# EAGLE design mega (EAGLE 9.2.2)
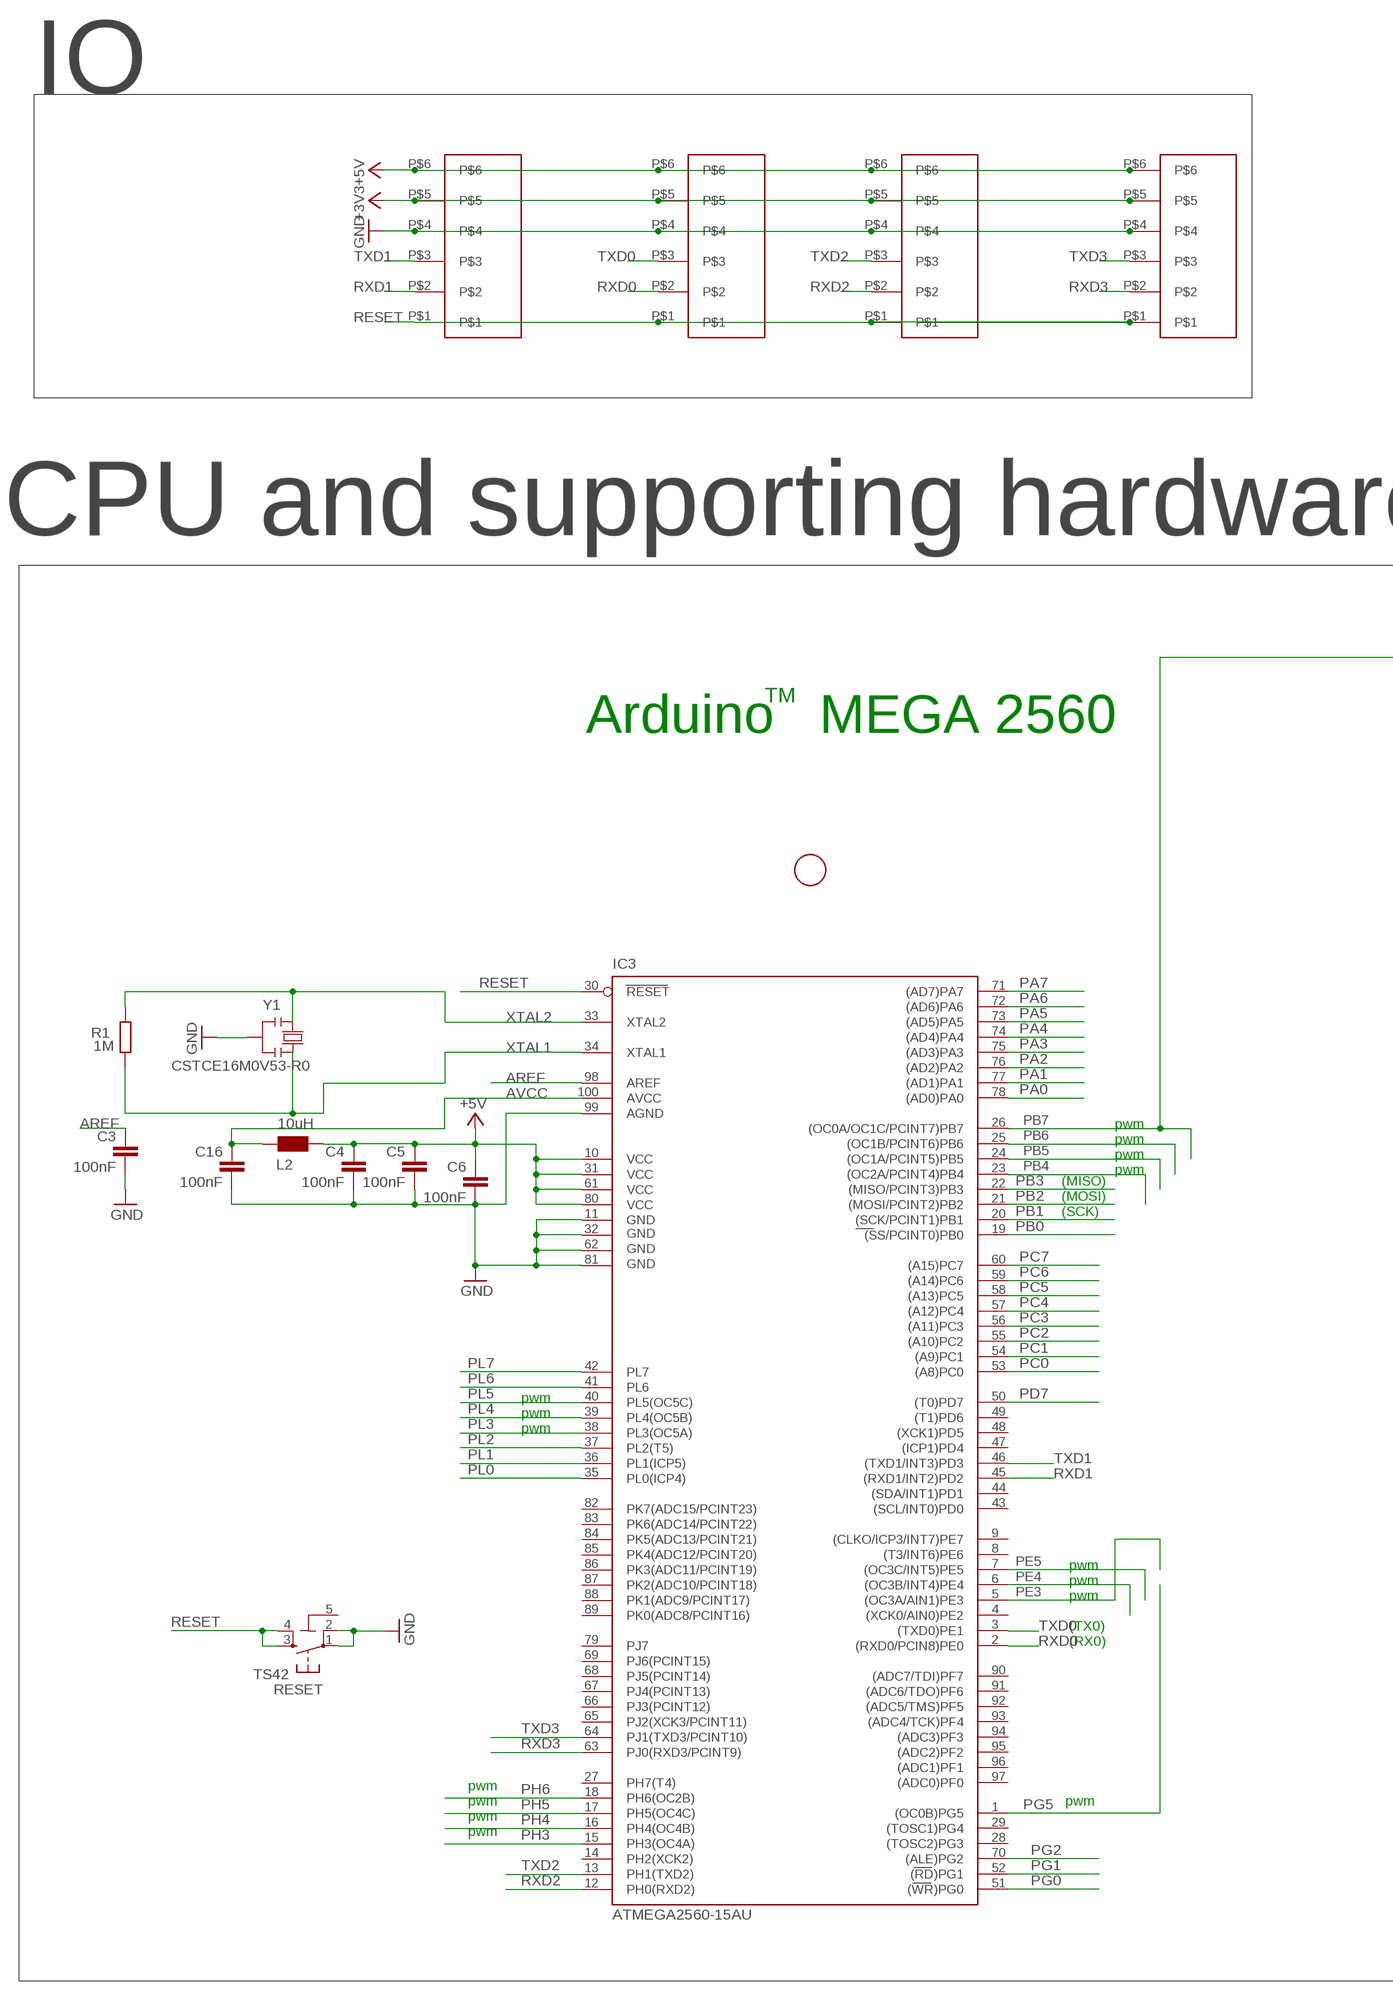
[diagram p0: schematic, sheet 1, part 1 of 2]
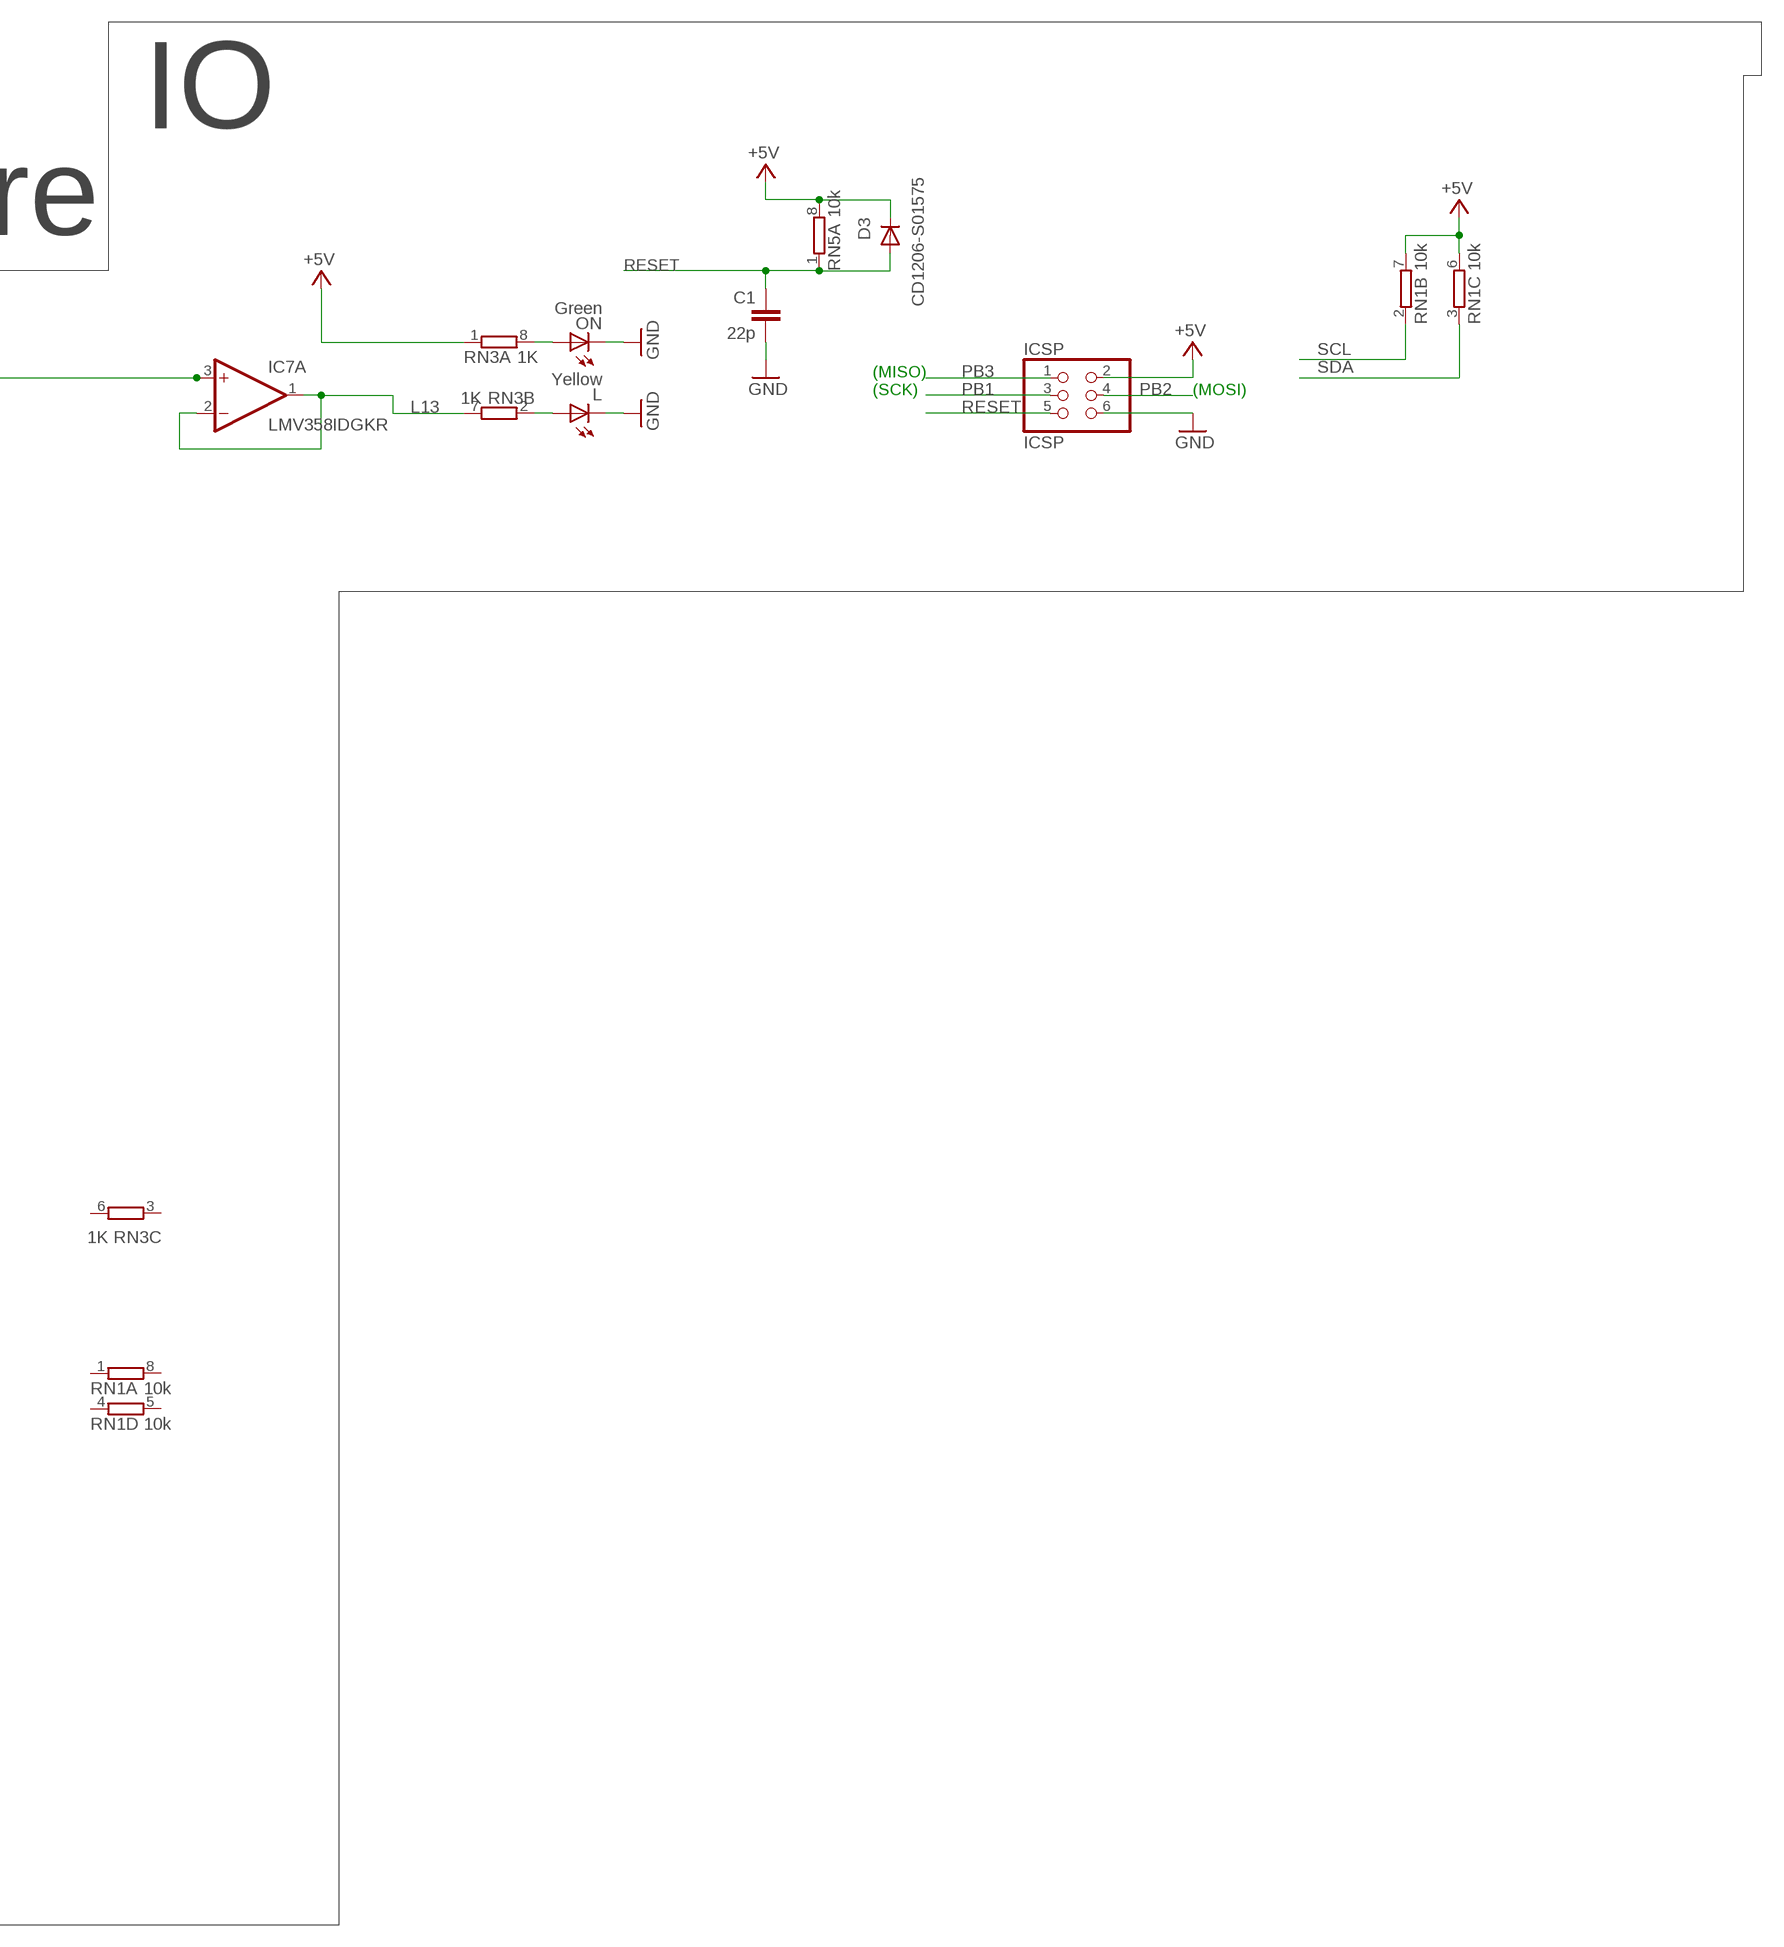
[diagram p1: schematic, sheet 1, part 2 of 2]

## Parts
C1  22p  0014_22PF_0603  [C0603-ROUND]
C3  100nF  0015_100NF_0603  [C0603-ROUND]
C4  100nF  0015_100NF_0603  [C0603-ROUND]
C5  100nF  0015_100NF_0603  [C0603-ROUND]
C6  100nF  0015_100NF_0603  [C0603-ROUND]
C16  100nF  0015_100NF_0603  [C0603-ROUND]
D3  CD1206-S01575  0012_CD1206-S01575  [MINIMELF]
FD4  FIDUCIALMOUNT  [FIDUCIA-MOUNT]
IC3  ATMEGA2560-15AU  0023_ATMEGA2560-16AU  [TQFP100]
IC7  LMV358IDGKR  0021_LMV358IDGKR  [MSOP08]
ICSP  ICSP  0114_PH254-203DF118A00V  [2X03]
L  Yellow  0044_KPT-2012YC  [CHIPLED_0805]
L2  10uH  0715_CV201210-100K  [0805]
ON  Green  0043_KPT-2012SGC  [CHIPLED_0805]
R1  1M  0004_0603_1M  [R0603-ROUND]
RESET  TS42  0946_TS42031-160W-TR-7260  [TS42]
RN1  10k  0016_064R_10K_/_CAY16-103J4LF  [CAY16]
RN3  1K  0005_064R_1K_/_CAY16-102J4LF  [CAY16]
RN5  10k  0016_064R_10K_/_CAY16-103J4LF  [CAY16]
U$2  6PINHERM  [6PINHERMSMD]
U$3  6PINHERM  [6PINHERMSMD]
U$4  6PINHERM  [6PINHERMSMD]
U$5  6PINHERM  [6PINHERMSMD]
Y1  CSTCE16M0V53-R0  0011_CSTCE16M0V53-R0  [RESONATOR]

## Nets
+3V3 [power]: U$2.P$5 U$3.P$5 U$4.P$5 U$5.P$5
+5V [power usb]: C4.1 C5.1 C6.1 D3.C IC3.10(VCC) IC3.31(VCC1) IC3.61(VCC2) IC3.80(VCC3) ICSP.2 L2.2 RN1.6 RN1.7 RN3.1 RN5.8 U$2.P$6 U$3.P$6 U$4.P$6 U$5.P$6
AREF: C3.1 IC3.98(AREF)
AVCC [power usb]: C16.1 IC3.100(AVCC) L2.1
GND [gnd]: C1.2 C3.2 C4.2 C5.2 C6.2 C16.2 IC3.11(GND) IC3.32(GND1) IC3.62(GND2) IC3.81(GND3) IC3.99(AGND) ICSP.6 L.C ON.C RESET.1 RESET.2 U$2.P$4 U$3.P$4 U$4.P$4 U$5.P$4 Y1.2
L13: IC7.1(A:OUT) IC7.2(A:-IN) RN3.7
N$2: L.A RN3.2
N$3: ON.A RN3.8
PA0: IC3.78((AD0)PA0)
PA1: IC3.77((AD1)PA1)
PA2: IC3.76((AD2)PA2)
PA3: IC3.75((AD3)PA3)
PA4: IC3.74((AD4)PA4)
PA5: IC3.73((AD5)PA5)
PA6: IC3.72((AD6)PA6)
PA7: IC3.71((AD7)PA7)
PB0: IC3.19((SS/PCINT0)PB0)
PB1: IC3.20((SCK/PCINT1)PB1) ICSP.3
PB2: IC3.21((MOSI/PCINT2)PB2) ICSP.4
PB3: IC3.22((MISO/PCINT3)PB3) ICSP.1
PB4: IC3.23((OC2A/PCINT4)PB4)
PB5: IC3.24((OC1A/PCINT5)PB5)
PB6: IC3.25((OC1B/PCINT6)PB6)
PB7: IC3.26((OC0A/OC1C/PCINT7)PB7) IC7.3(A:+IN)
PC0: IC3.53((A8)PC0)
PC1: IC3.54((A9)PC1)
PC2: IC3.55((A10)PC2)
PC3: IC3.56((A11)PC3)
PC4: IC3.57((A12)PC4)
PC5: IC3.58((A13)PC5)
PC6: IC3.59((A14)PC6)
PC7: IC3.60((A15)PC7)
PD7: IC3.50((T0)PD7)
PE3: IC3.5((OC3A/AIN1)PE3)
PE4: IC3.6((OC3B/INT4)PE4)
PE5: IC3.7((OC3C/INT5)PE5)
PG0: IC3.51((WR)PG0)
PG1: IC3.52((RD)PG1)
PG2: IC3.70((ALE)PG2)
PG5: IC3.1((OC0B)PG5)
PH3: IC3.15(PH3(OC4A))
PH4: IC3.16(PH4(OC4B))
PH5: IC3.17(PH5(OC4C))
PH6: IC3.18(PH6(OC2B))
PL0: IC3.35(PL0(ICP4))
PL1: IC3.36(PL1(ICP5))
PL2: IC3.37(PL2(T5))
PL3: IC3.38(PL3(OC5A))
PL4: IC3.39(PL4(OC5B))
PL5: IC3.40(PL5(OC5C))
PL6: IC3.41(PL6)
PL7: IC3.42(PL7)
RESET: C1.1 D3.A IC3.30(RESET) ICSP.5 RESET.3 RESET.4 RN5.1 U$2.P$1 U$3.P$1 U$4.P$1 U$5.P$1
RXD0: IC3.2((RXD0/PCIN8)PE0) U$4.P$2
RXD1: IC3.45((RXD1/INT2)PD2) U$2.P$2
RXD2: IC3.12(PH0(RXD2)) U$5.P$2
RXD3: IC3.63(PJ0(RXD3/PCINT9)) U$3.P$2
SCL: RN1.2
SDA: RN1.3
TXD0: IC3.3((TXD0)PE1) U$4.P$3
TXD1: IC3.46((TXD1/INT3)PD3) U$2.P$3
TXD2: IC3.13(PH1(TXD2)) U$5.P$3
TXD3: IC3.64(PJ1(TXD3/PCINT10)) U$3.P$3
XTAL1: IC3.34(XTAL1) R1.1 Y1.3
XTAL2: IC3.33(XTAL2) R1.2 Y1.1
Unconnected: IC3.4((XCK0/AIN0)PE2) IC3.8((T3/INT6)PE6) IC3.9((CLKO/ICP3/INT7)PE7) IC3.14(PH2(XCK2)) IC3.27(PH7(T4)) IC3.28((TOSC2)PG3) IC3.29((TOSC1)PG4) IC3.43((SCL/INT0)PD0) IC3.44((SDA/INT1)PD1) IC3.47((ICP1)PD4) IC3.48((XCK1)PD5) IC3.49((T1)PD6) IC3.65(PJ2(XCK3/PCINT11)) IC3.66(PJ3(PCINT12)) IC3.67(PJ4(PCINT13)) IC3.68(PJ5(PCINT14)) IC3.69(PJ6(PCINT15)) IC3.79(PJ7) IC3.82(PK7(ADC15/PCINT23)) IC3.83(PK6(ADC14/PCINT22)) IC3.84(PK5(ADC13/PCINT21)) IC3.85(PK4(ADC12/PCINT20)) IC3.86(PK3(ADC11/PCINT19)) IC3.87(PK2(ADC10/PCINT18)) IC3.88(PK1(ADC9/PCINT17)) IC3.89(PK0(ADC8/PCINT16)) IC3.90((ADC7/TDI)PF7) IC3.91((ADC6/TDO)PF6) IC3.92((ADC5/TMS)PF5) IC3.93((ADC4/TCK)PF4) IC3.94((ADC3)PF3) IC3.95((ADC2)PF2) IC3.96((ADC1)PF1) IC3.97((ADC0)PF0) IC7.5(B:+IN) IC7.6(B:-IN) IC7.7(B:OUT) RN1.1 RN1.4 RN1.5 RN1.8 RN3.3 RN3.4 RN3.5 RN3.6 RN5.2 RN5.3 RN5.4 RN5.5 RN5.6 RN5.7

## Notes on the sheet
- IO
- IO
- CPU and supporting hardware
- (MISO)
- (SCK) | (MOSI)
- TM
- Arduino   MEGA 2560
- pwm
- pwm
- pwm
- pwm
- (MISO)
- (MOSI)
- (SCK)
- pwm
- pwm
- pwm
- pwm
- pwm
- pwm
- (TX0)
- (RX0)
- pwm
- pwm | pwm
- pwm
- pwm

## Power pins joined to a net without a drawn wire
5-GND: RESET.5(5-GND)
V+: IC7.8(P:V+)
V-: IC7.4(P:V-)

## Library data of the parts
C1 = Condensatori:0014_22PF_0603: 22pF 0603; CASE: 0603; MONTHLY_USAGE: _____; PART_NUMBER: 22pF_0603; PRICE: _____; SUPPLIER: _____; TYPE: Condensatori
C3-C6 C16 = Condensatori:0015_100NF_0603: 100nF 0603 50V; CASE: 0603; MONTHLY_USAGE: _____; PART_NUMBER: cl10b104kbnc; PRICE: _____; SUPPLIER: _____; TYPE: Condensatori
D3 = Diodi:0012_CD1206-S01575: small-signal high-speed Switching Diodes CD1206; CASE: 1206; MONTHLY_USAGE: _____; PART_NUMBER: CD1206-S01575; PRICE: _____; SUPPLIER: _____; TYPE: Diodi
FD4 = SmartPrj:FIDUCIALMOUNT
IC3 = IntegratedCircuits:0023_ATMEGA2560-16AU: 8-bit Microcontroller with 256K Bytes In-System Programmable Flash - ATMEGA2560-16AU; CASE: TQFP100_14x14; MONTHLY_USAGE: _____; PART_NUMBER: ATMEGA2560-16AU; PRICE: _____; SUPPLIER: _____; TYPE: Circuito_Integrato
IC7 = IntegratedCircuits:0021_LMV358IDGKR: Dual low-voltage (2.7 V to 5.5 V), operational amplifiers with rail-to-rail output swing LMV358IDGKR; CASE: MSOP8; MONTHLY_USAGE: _____; PART_NUMBER: LMV358IDGKR; PRICE: _____; SUPPLIER: _____; TYPE: Circuito_Integrato
ICSP = Connettori:0114_PH254-203DF118A00V: 3x2 M V h 8,5 mm p2,54; MONTHLY_USAGE: _____; PART_NUMBER: PH254-203DF118A00V; PRICE: _____; SUPPLIER: _____; TYPE: Connettori
L = Opto:0044_KPT-2012YC: LED YELLOW - SMD - 0805; MONTHLY_USAGE: _____; PART_NUMBER: KPT-2012YC; PRICE: _____; SUPPLIER: _____; TYPE: Opto
L2 = Induttanze:0715_CV201210-100K: 10uH 0805; CASE: 0805; MONTHLY_USAGE: _____; PART_NUMBER: CV201210-100K; PRICE: _____; SUPPLIER: _____; TYPE: Induttanze
ON = Opto:0043_KPT-2012SGC: LED GREEN - SMD-0805; MONTHLY_USAGE: _____; PART_NUMBER: KPT-2012SGC; PRICE: _____; SUPPLIER: _____; TYPE: Opto
R1 = Resistenze:0004_0603_1M: 1M 0603; CASE: 0603; MONTHLY_USAGE: _____; PART_NUMBER: 0603_1M; PRICE: _____; SUPPLIER: _____; TYPE: Resistenze
RESET = Switches:0946_TS42031-160W-TR-7260: Pushbutton 6x6 Smd - White; MONTHLY_USAGE: _____; PART_NUMBER: IT-1157AHNP-160G-G_GTR; PRICE: _____; SUPPLIER: _____; TYPE: Switches
RN1 RN5 = Resistenze:0016_064R_10K_/_CAY16-103J4LF: 10K 064 R; CASE: SMD_3,2x1,6; MONTHLY_USAGE: _____; PART_NUMBER: 064R_10K_/_CAY16-103J4LF; PRICE: _____; SUPPLIER: _____; TYPE: Resistenze
RN3 = Resistenze:0005_064R_1K_/_CAY16-102J4LF: 1K 064R; CASE: SMD_3,2x1,6; MONTHLY_USAGE: _____; PART_NUMBER: 064R_1K_/_CAY16-102J4LF; PRICE: _____; SUPPLIER: _____; TYPE: Resistenze
U$2-U$5 = te_conectivity_6_pin_herm:6PINHERM: https://www.mouser.com/ProductDetail/TE-Connectivity/2213611-3?qs=sGAEpiMZZMsg%252bek5lc7F5uB08Utn55q4E3YUmFQRoIY%3d
Y1 = Cristalli:0011_CSTCE16M0V53-R0: 16Mhz - SMD; MONTHLY_USAGE: _____; PART_NUMBER: CSTCE16M0V53-R0; PRICE: _____; SUPPLIER: _____; TYPE: Cristalli

## Net classes
0 default: width 0.203 mm, drill 0.406 mm, clearance 0.203 mm
1 power: width 0.61 mm, drill 0.406 mm, clearance 0.203 mm
2 gnd: width 0.305 mm, drill 0.406 mm, clearance 0.203 mm
3 power usb: width 0.508 mm, drill 0.406 mm, clearance 0.203 mm

## Board
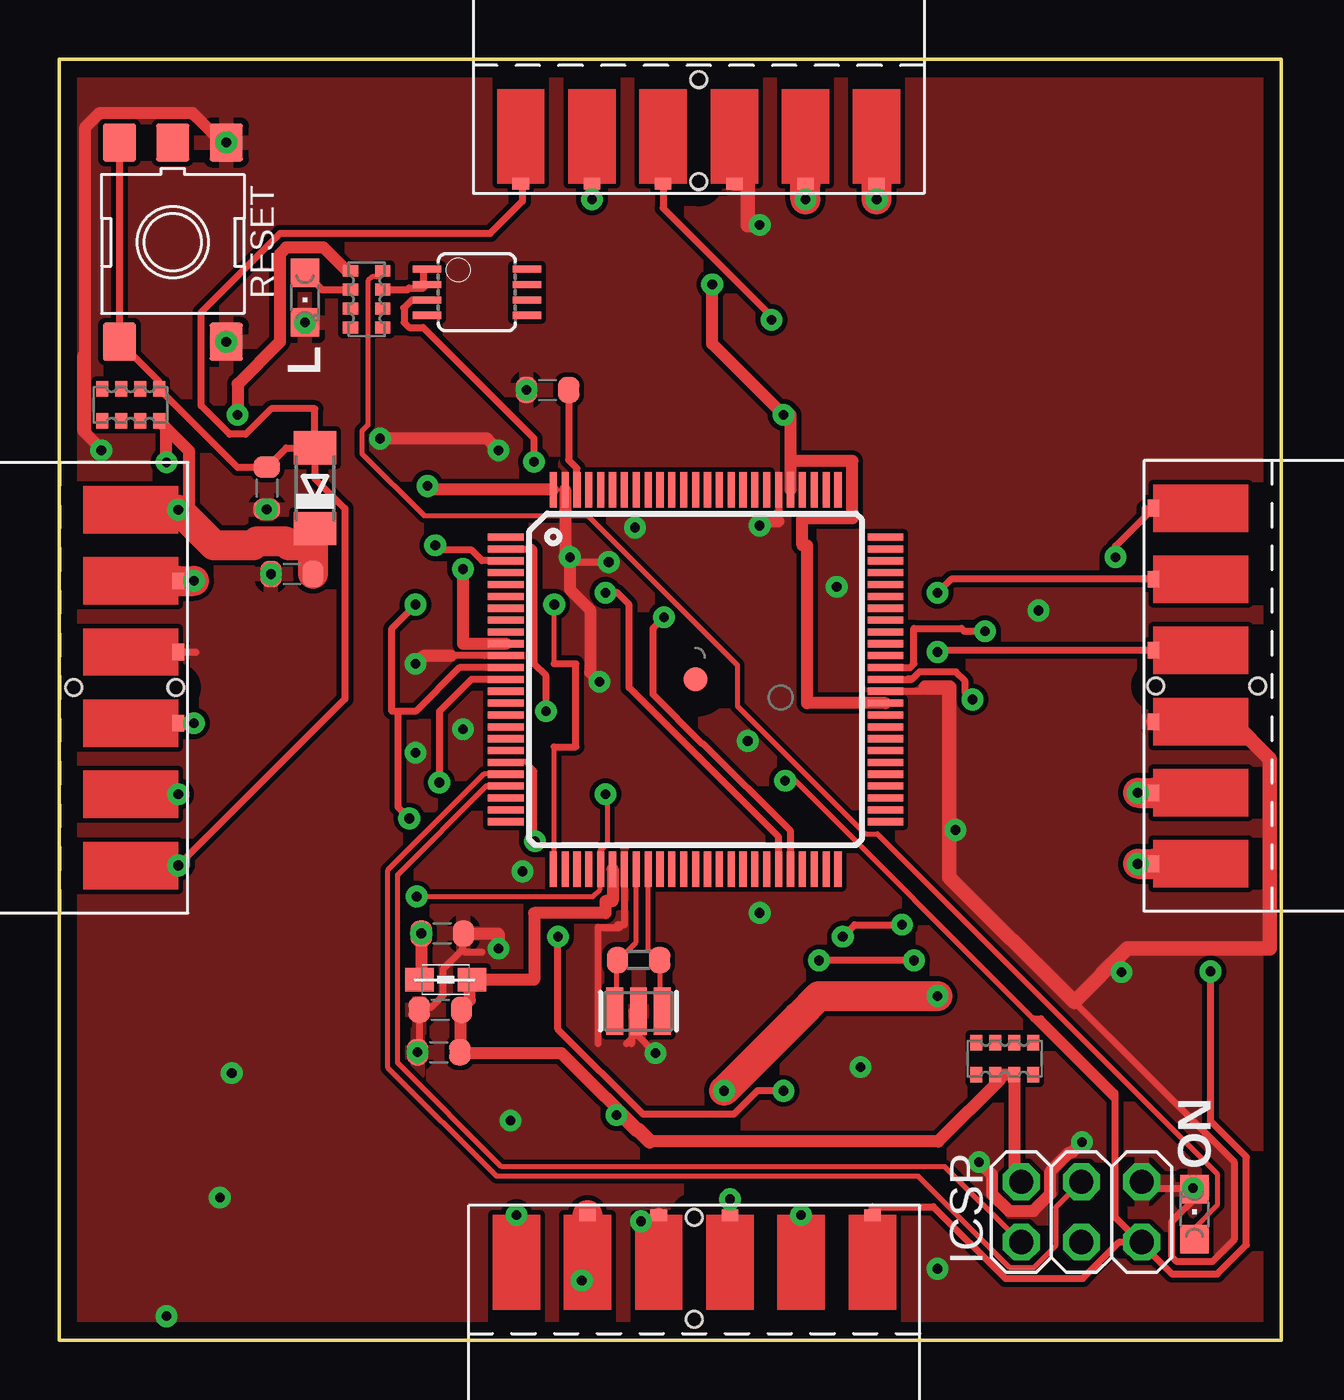
[diagram p2: board, top side]
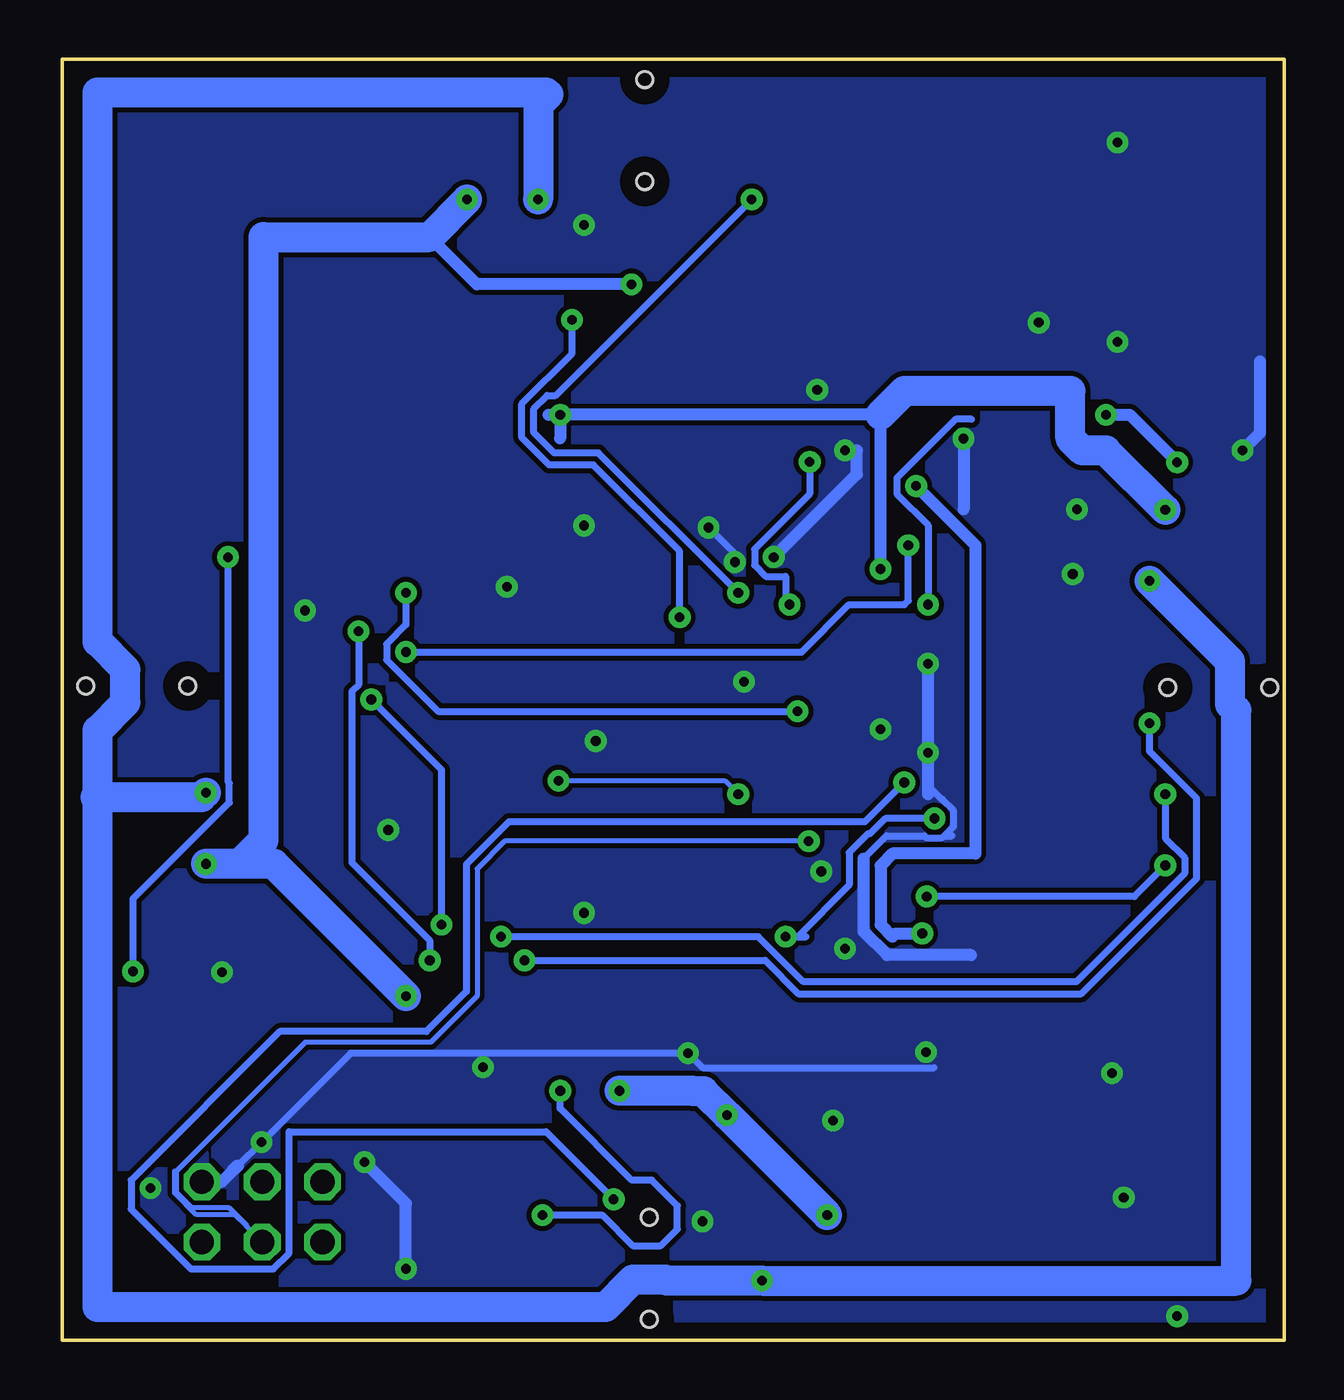
[diagram p3: board, bottom side, seen from below]

Size 51.5 x 54 mm. Coordinates in mm from the lower left corner, seen from the top.
Outline: 0,54 51.5,54 51.5,0 0,0 0,54
Copper layers (1*16): Top 0.035mm / dielectric 1.5mm / Bottom 0.035mm
Design rules "ArduinoMega *": minimum track width 8mil, minimum drill 16mil, track to track 7mil, track to pad 7mil, pad to pad 8mil, via to via 10mil, smd to smd 7mil, copper to edge 27mil, drill to drill 12mil, minimum pad ring 10mil, minimum via ring 10mil, stop-mask expansion 2mil, vias tented up to drill 24mil, thermal gap 10mil

### Footprints (pad centres in the part's own frame; a part is rotated, then mirrored left to right if it is on the bottom)
C0603-ROUND = smd 0.898 x 1.1: 1 -0.889,0; 2 0.889,0
MINIMELF = smd 1.4 x 1.8: A 1.7,0; C -1.7,0
FIDUCIA-MOUNT = smd 1.016 x 1.016: P$1 0,0
TQFP100 = smd 1.5 x 0.3: 1 -8,6; 2 -8,5.5; 3 -8,5; 4 -8,4.5; 5 -8,4; 6 -8,3.5; 7 -8,3; 8 -8,2.5; 9 -8,2; 10 -8,1.5; 11 -8,1; 12 -8,0.5; 13 -8,0; 14 -8,-0.5; 15 -8,-1; 16 -8,-1.5; 17 -8,-2; 18 -8,-2.5; 19 -8,-3; 20 -8,-3.5; 21 -8,-4; 22 -8,-4.5; 23 -8,-5; 24 -8,-5.5; 25 -8,-6; 51 8,-6; 52 8,-5.5; 53 8,-5; 54 8,-4.5; 55 8,-4; 56 8,-3.5; 57 8,-3; 58 8,-2.5; 59 8,-2; 60 8,-1.5; 61 8,-1; 62 8,-0.5; 63 8,0; 64 8,0.5; 65 8,1; 66 8,1.5; 67 8,2; 68 8,2.5; 69 8,3; 70 8,3.5; 71 8,4; 72 8,4.5; 73 8,5; 74 8,5.5; 75 8,6 | smd 0.3 x 1.5: 26 -6,-8; 27 -5.5,-8; 28 -5,-8; 29 -4.5,-8; 30 -4,-8; 31 -3.5,-8; 32 -3,-8; 33 -2.5,-8; 34 -2,-8; 35 -1.5,-8; 36 -1,-8; 37 -0.5,-8; 38 0,-8; 39 0.5,-8; 40 1,-8; 41 1.5,-8; 42 2,-8; 43 2.5,-8; 44 3,-8; 45 3.5,-8; 46 4,-8; 47 4.5,-8; 48 5,-8; 49 5.5,-8; 50 6,-8; 76 6,8; 77 5.5,8; 78 5,8; 79 4.5,8; 80 4,8; 81 3.5,8; 82 3,8; 83 2.5,8; 84 2,8; 85 1.5,8; 86 1,8; 87 0.5,8; 88 0,8; 89 -0.5,8; 90 -1,8; 91 -1.5,8; 92 -2,8; 93 -2.5,8; 94 -3,8; 95 -3.5,8; 96 -4,8; 97 -4.5,8; 98 -5,8; 99 -5.5,8; 100 -6,8
MSOP08 = smd 0.3 x 1.2: 1 -0.976,-2.113; 2 -0.326,-2.113; 3 0.324,-2.113; 4 0.974,-2.113; 5 0.974,2.112; 6 0.324,2.112; 7 -0.326,2.112; 8 -0.976,2.112
2X03 = drill 1.016 pad 1.55 octagon: 1 -2.54,-1.27; 2 -2.54,1.27; 3 0,-1.27; 4 0,1.27; 5 2.54,-1.27; 6 2.54,1.27
CHIPLED_0805 = smd 1.2 x 1.2: A 0,-1.05; C 0,1.05
0805 = smd 1.2 x 1: 1 -1.1,0; 2 1.1,0
R0603-ROUND = smd 0.898 x 1.1: 1 -0.889,0; 2 0.889,0
TS42 = smd 1.6 x 1.4: 1 -4.2,2.25; 2 4.2,2.25; 3 -4.2,-2.25; 4 4.2,-2.25; 5 -4.2,0
CAY16 = smd 0.5 x 0.65: 1 -1.2,-0.675; 2 -0.4,-0.675; 3 0.4,-0.675; 4 1.2,-0.675; 5 1.2,0.675; 6 0.4,0.675; 7 -0.4,0.675; 8 -1.2,0.675
6PINHERMSMD = smd 0.5 x 0.7: P$1 -5,17; P$2 -5,14; P$3 -5,11; P$4 -5,8; P$5 -5,5; P$6 -5,2 | hole 0.65: -4.9,9.5; -0.6,9.5 | hole 0.7: -4.9,9.5; -0.6,9.5
RESONATOR = smd 0.7 x 2: 1 -1,0; 2 0,0; 3 1,0

### Placement (x,y rotation side)
C1  8.74,35.92 270 top
C3  20.57,40.06 180 top
C4  9.81,32.3 180 top
C5  15.98,12.14 180 top
C6  16.06,13.93 180 top
C16  16.14,17.15 0 top
D3  10.77,35.92 90 top
FD4  26.81,27.86 0 top
IC3  26.81,27.86 0 top
IC7  17.6,44.18 270 top
ICSP  43.07,5.41 0 top
L  10.35,43.95 180 top
L2  16.28,15.2 0 top
ON  47.84,5.31 0 top
R1  24.41,16.02 180 top
RESET  4.78,46.29 270 top
RN1  39.84,11.87 180 top
RN3  12.95,43.88 270 top
RN5  3,39.43 180 top
U$2  36.45,53.75 90 top
U$3  0.01,37.01 180 top
U$4  51.11,18.08 0 top
U$5  17.26,0.28 270 top
Y1  24.41,13.87 0 top

### Tracks (layer width: path | path; a pad name or v marks a point on that pad's centre or on a via)
+3V3  (via drill 0.41)
  Top 1.27: U$5.P$5 22.26,2.76 v22.01,2.51 | v45.45,23.08 U$4.P$5 | v31.45,48.09 U$2.P$5 | U$3.P$5 v5.67,32.01
  Bottom 1.27: 50.01,22.81 50.01,1.4 28.6,1.4 27.45,2.55 26.07,2.55 26.04,2.51 v22.01,2.51 2.01,2.51 2.01,26.55 2.29,26.82 2.29,28.62 v5.67,32.01 | 50.01,22.81 50.1,22.9 45.63,22.9 v45.45,23.08 | 50.01,22.81 50.01,25.71 48.84,26.89 48.84,28.27 50.01,29.45 50.01,52.6 31.11,52.6 31.01,52.51 31.45,52.08 v31.45,48.09
+5V  (via drill 0.41)
  Top 0.508: ICSP.2 40.47,6.72 40.26,6.92 40.26,10.98 RN1.7 40.16,11.19 RN1.6 39.65,10.98 37.04,8.37 24.89,8.37 21.16,12.1 17.1,12.1 C5.1 16.89,12.2 16.89,13.93 C6.1 17.1,14.13 17.3,14.34 17.3,15.15 L2.2 20.01,15.2 20.01,18.01 23.01,18.01 23.01,18.51 23.31,18.51 IC3.31 | IC3.10 17.01,29.36 v17.01,32.51 | IC3.80 30.81,37.07 | 30.81,37.07 30.81,39.01 v30.51,39.01 27.51,42.01 v27.51,44.51 | IC3.61 31.51,26.86 31.51,33.51 31.31,33.51 31.31,34.65 33.42,34.65 33.42,37.07 30.81,37.07 | U$3.P$6 5.47,35.01 5.47,37.48 RN5.8 4.51,38.44 v4.51,37.01 | v7.51,39.01 7.51,40.32 9.29,42.1 9.29,45.79 9.56,46.06 11.14,46.06 12.12,45.08 RN3.1
  Top 0.61: 24.89,8.37 24.4,8.86 24.33,8.86 23.7,9.5 v23.48,9.5
  Top 1.27: v28.01,10.51 31.14,13.64 32.01,14.51 v37.01,14.51 | v45.45,20.08 U$4.P$6 | v34.45,48.09 U$2.P$6 | U$3.P$6 6.51,33.51 8.15,33.51 8.33,33.69 9.5,33.69 9.68,33.51 10.07,33.51 D3.C 10.7,34.14 C4.1
  Bottom 0.508: v30.51,39.01 17.01,39.01 v17.01,32.51 | 31.01,39.01 v30.51,39.01 | v30.51,39.01 30.51,38.01 | v27.51,44.51 34.02,44.51 36.02,46.51 | v7.51,39.01 6.51,39.01 v4.51,37.01
  Bottom 1.27: U$5.P$6 v23.48,9.5 24.49,10.5 24.93,10.5 24.94,10.51 v28.01,10.51 | v37.01,14.51 42.58,20.08 44.01,20.08 | 44.01,20.08 v45.45,20.08 | 44.01,20.08 43.01,21.08 43.01,46.51 36.02,46.51 v34.45,48.09 | U$3.P$6 7.51,37.51 8.51,37.51 9.01,38.01 9.01,40.01 16.01,40.01 17.01,39.01
  other vias: 19.26,5.28 5.01,35.01
AREF
  Top 0.203: 21.77,36.79 21.77,35.88 IC3.98
  Top 0.305: C3.1 21.46,37.11 21.81,36.76 IC3.98
AVCC  (via drill 0.41)
  Top 0.508: C16.1 15.27,17.08 15.27,15.25 L2.1 | IC3.100 15.67,35.86 v15.51,36.01
  Bottom 0.508: v15.51,36.01 13.01,33.51 13.01,20.51 16.51,20.51 17.01,20.01 17.01,17.51 16.51,17.01 16.38,17.15 C16.1
  other vias: 15.25,17.15
GND  (via drill 0.41)
  Top 0.305: v47.78,6.41 45.85,6.41 45.65,6.61 ICSP.6 | C5.2 15.17,12.2 C6.2 15.27,14.03 15.68,14.03 16.18,14.54 16.18,15.66 17,16.47 | 17,16.47 17,17.08 C16.2 | 23.9,12.51 24.31,12.91 | 17.81,16.37 17.1,16.37 17,16.47 | 24.31,12.91 v25.12,12.1 | 36.51,27.51 36.36,27.36 IC3.62 | IC3.32 23.81,17.51 23.62,17.51 | 23.62,17.51 23.51,17.51 | 24.31,12.91 24.31,13.87 Y1.2 24.11,13.87 24.11,12.51 | 23.62,17.51 23.62,17.4 22.7,17.4 22.7,12.51 | 17.91,28.86 IC3.11 15.36,28.86 | 42.76,14.26 49.51,7.51 49.51,4.23 48.59,3.31 47.1,3.31 46.89,3.52 46.89,5.01 47.99,6.12 47.99,6.51 ON.C | IC3.81 30.31,34.51 | U$3.P$4 5.76,29.01 | v21.51,33.01 21.72,32.8 v23.16,32.8
  Top 0.508: v29.51,34.35 29.51,34.51 30.31,34.51 | IC3.99 21.31,33.01 v21.51,33.01 21.51,31.65 22.37,30.79 22.37,28.15 v22.76,27.76 | C16.2 18.51,17.15 v18.51,16.51 | ON.C 47.8,6.41 v47.78,6.41 | v18.51,37.51 18.01,38.01 v13.51,38.01 | v15.01,28.51 15.36,28.86 16.51,28.86 | v43.1,8.35 42.66,7.91 42.56,7.91 41.77,7.11 41.77,6.17 41.04,5.45 40.02,5.45 39.3,6.17 39.3,6.97 v38.76,7.51 | 1.1,38.24 1.02,38.32 1.02,41.51 | v1.76,37.51 1.76,37.57 1.1,38.24 | 1.1,38.24 1.1,51.14 1.7,51.75 5.61,51.75 6.87,50.49 RESET.1
  Top 0.61: U$4.P$4 49.45,26.08 51.01,24.51 51.01,16.51 45.01,16.51 42.76,14.26 37.51,19.51 37.51,27.51 36.51,27.51 | U$2.P$4 29.01,48.75 29.01,47.01 v29.51,47.01 | U$5.P$4 25.26,5.01 v24.51,5.01
  Bottom 0.305: 44.1,7.35 v43.1,8.35 39.35,12.1 v25.12,12.1 24.51,11.49 14.76,11.49 | 17.72,20.31 16.77,21.26 15.16,21.26 15.08,21.18 14.41,21.18 14.33,21.26 | 14.33,21.26 14.01,21.26 | 15.01,23.51 15.08,23.44 14.44,22.81 14.41,22.81 13.93,22.33 13.93,21.66 14.33,21.26 | v23.16,32.8 23.16,33.15 v24.26,34.26
  Bottom 0.508: v21.51,33.01 18.01,36.51 18.01,37.51 v18.51,37.51 | v13.51,38.01 13.51,35.02 | 17.72,20.31 17.72,17.22 16.74,16.23 13.2,16.23 | 15.01,23.02 15.01,23.51 v15.01,24.76 v15.01,28.51 | v1.76,37.51 1.02,38.26 1.02,41.26 | ICSP.6 44.77,6.68 44.31,7.14 44.31,7.19 | 44.31,7.19 44.12,7.37 | v37.01,3.01 37.01,5.76 v38.76,7.51 | 44.1,7.35 44.26,7.19 44.31,7.19
  other vias: 7.03,42.09 10.35,42.9 7.03,50.49 8.74,35.03 8.92,32.3 19.68,40.06 15.1,12.14 4.51,1.01 6.76,6.01 7.26,11.26 19.01,9.26 33.76,11.51 44.76,15.51 37.76,21.51 41.26,30.76 17.01,25.76 29.51,18.01 32.76,31.76 19.51,19.76 29.01,25.26
  pour Top: 0.01,54.01 51.51,54.01 51.51,0.01 0.01,0.01
  pour Bottom: 0.01,0.01 51.51,0.01 51.51,54.01 0.01,54.01
L13
  Top 0.305: RN3.7 14.66,44.28 14.74,44.36 15.34,44.36 | 15.34,44.36 IC7.2 | IC7.1 15.34,45.01 15.34,44.36
N$2
  Top 0.305: L.A 11.07,44.28 RN3.2
N$3
  Top 0.203: ON.A 47.88,4.28 47.88,4.79 48.8,5.7 48.8,7.02 34.47,21.35 33.96,21.35 28.58,26.73 28.58,28.46 22.28,34.76 15.37,34.76 12.75,37.38 12.75,38.33 13,38.58 13,44.66 13.18,44.84 13.38,44.84 RN3.8
PB1  (via drill 0.41)
  Top 0.203: v20.04,21.04 20.04,23.99 19.64,24.39 18.82,24.39 IC3.20
  Bottom 0.203: v20.04,21.04 32.85,21.04 34.01,19.87 34.01,14.51 35.97,12.56 41.26,12.56 46.69,7.13 46.69,6.23 46.06,5.6 44.48,5.6 43.73,4.84 43.73,4.8 | 46.77,7.12 46.77,6.21 45.85,5.29 44.22,5.29 43.73,4.8 | 43.73,4.8 43.11,4.18 ICSP.3
PB2
  Top 0.203: IC3.21 18.72,23.89 17.91,23.89 13.85,19.82 13.85,11.49 18.43,6.91 36.21,6.91 40.06,3.06 41.08,3.06 41.99,3.97 41.99,5.6 43.01,6.61 ICSP.4
PB3
  Top 0.203: IC3.22 18.72,23.38 18.01,23.38 14.25,19.62 14.25,11.69 18.63,7.32 37.32,7.32 40.47,4.18 ICSP.1
PB7  (via drill 0.41)
  Top 0.203: 20.86,28.51 v20.86,31.01 | 20.86,25.01 20.86,19.92 IC3.26
  Top 0.305: 20.86,25.01 21.76,25.01 21.76,28.51 20.86,28.51 | IC7.3 14.85,43.85 14.51,43.51 14.53,43.5 14.53,42.91 14.74,42.7 15.33,42.7 20,38.02 v20,37.02
  Bottom 0.305: v20,37.02 20,35.67 22.33,33.35 22.33,32.67 21.85,32.2 21.01,32.2 21.01,31.17 v20.86,31.01
RESET  (via drill 0.41)
  Top 0.203: ICSP.5 45.55,4.18 44.53,5.19 44.53,10.07 41.05,13.55 31.01,23.59 v30.59,23.59 | v15.07,18.7 22.48,18.7 22.79,19.01 22.79,19.82 IC3.30 22.79,19.92 22.79,20.64 23.09,20.94 23.09,22.93 v23.01,23.01
  Top 0.305: D3.A 9.55,37.62 C1.1 7.5,36.81 RN5.1 4.2,40.42 RESET.4 RESET.3 | D3.A 10.77,36.32 12.03,35.06 12.03,27.03 5.37,20.37 5.37,20.01 U$3.P$1 | D3.A 10.77,39.27 8.92,39.27 7.85,38.2 7.18,38.2 5.98,39.4 5.98,43.34 9.31,46.67 18.17,46.67 19.51,48.01 19.51,48.68 U$2.P$1 | 34.26,5.51 U$5.P$1 34.26,5.63 36.84,5.63 39.87,2.6 43.14,2.6 44.67,4.14 ICSP.5 | v48.51,15.55 48.51,9.23 50.02,7.72 50.02,4.02 48.8,2.8 46.89,2.8 44.48,5.2 44.48,10.44 41.37,13.55 41.05,13.55 | v44.51,33.01 44.51,33.48 45.75,34.72 | 45.75,34.72 45.75,35.08 | U$4.P$1 45.75,34.72
  Bottom 0.203: v30.59,23.59 23.59,23.59 v23.01,23.01
  Bottom 0.305: U$3.P$1 6.32,18.7 v15.07,18.7 | v48.51,15.55 48.51,18.62 44.46,22.67 44.46,23.49 44.51,23.55 v44.51,33.01
  other vias: 5.01,20.01
RXD0  (via drill 0.41)
  Top 0.305: U$4.P$2 37.58,32.08 v37.01,31.51 | v20.51,26.51 20.51,28.01 20.01,28.51 20.01,33.33 19.98,33.36 | 19.98,33.36 19.92,33.42 19.78,33.42 19.72,33.36 | IC3.2 19.98,33.36
  Bottom 0.305: v37.01,31.51 37.01,30.16 37.83,29.35 37.83,28.68 35.66,26.51 v20.51,26.51
RXD1  (via drill 0.41)
  Top 0.305: IC3.45 30.31,21.21 24.01,27.51 24.01,31.01 23.51,31.51 v23.01,31.51 | 22.45,48.39 v22.45,48.09 U$2.P$2
  Bottom 0.305: v23.01,31.51 28.9,37.4 30.77,37.4 31.62,38.26 31.62,39.27 31.06,39.83 30.71,39.83 v22.45,48.09
RXD2  (via drill 0.41)
  Top 0.305: v30.51,10.51 29.42,10.51 28.42,9.52 24.6,9.52 21.01,13.11 v21.01,17.01 | IC3.12 16.86,28.36 15.01,26.51 14.26,26.51 | v15.01,31.01 14.01,30.01 14.01,26.51 14.26,26.51 | 14.26,26.51 14.26,22.48 v14.75,21.99
  Bottom 0.305: v30.51,10.51 30.51,9.77 27.5,6.75 26.65,6.75 25.57,5.67 25.57,4.68 26.27,3.99 27.46,3.99 28.75,5.28 U$5.P$2 | 13.18,38.83 13.85,38.83 16.33,36.35 16.33,35.67 15.01,34.36 v15.01,31.01 | v21.01,17.01 20.51,17.01 | 20.51,17.01 20.16,17.01 | 20.51,17.01 18.33,19.19 18.33,20.56 17.55,21.35 17.46,21.35 16.81,21.99 v14.75,21.99
  other vias: 31.26,5.28
RXD3  (via drill 0.41)
  Top 0.305: v33.01,17.01 33.51,17.51 v35.51,17.51 | v38.48,27.01 38.17,27.32 38.17,27.79 37.79,28.17 36.24,28.17 35.93,27.87 | 35.93,27.87 35.72,27.87 | IC3.63 35.93,27.86 35.93,27.87
  Bottom 0.305: v33.01,17.01 22.16,17.01 20.27,15.12 8.76,15.12 4.2,19.68 4.2,20.35 5.01,21.16 U$3.P$2 | v35.51,17.51 35.51,24.05 v38.48,27.01
  other vias: 5.01,23.01
TXD0  (via drill 0.41)
  Top 0.305: U$4.P$3 37.08,29.08 v37.01,29.01 | v15.85,33.51 16.03,33.33 17.35,33.33 17.82,32.86 IC3.3
  Bottom 0.305: v37.01,29.01 20.35,29.01 18.35,31.01 16.01,31.01 15.85,31.18 v15.85,33.51
TXD1  (via drill 0.41)
  Top 0.305: IC3.46 30.81,21.46 27.13,25.14 27.1,25.14 25.02,27.22 25.02,30.02 v25.48,30.48 | v30.01,43.01 30.01,43.16 25.45,47.73 U$2.P$3
  Bottom 0.305: v25.48,30.48 25.48,33.26 29.11,36.89 30.98,36.89 32.13,38.05 32.13,39.48 30.01,41.59 v30.01,43.01
TXD2  (via drill 0.41)
  Top 0.305: IC3.13 17.36,27.86 16.01,26.51 v16.01,23.51 | 28.26,5.63 v28.26,5.94 U$5.P$3
  Bottom 0.305: v16.01,23.51 17.67,21.85 32.68,21.85 34.47,20.06 34.47,14.7 36.16,13.02 42.33,13.02 48.59,6.75 48.59,5.52 46.08,3.01 42.61,3.01 41.94,3.67 41.94,8.79 31.11,8.79 v28.26,5.94
TXD3  (via drill 0.41)
  Top 0.305: IC3.64 35.86,28.36 36.01,28.51 36.01,30.01 38.01,30.01 38.13,29.89 v39.01,29.89 | v36.01,16.01 v32.01,16.01 | 5.37,26.01 v5.67,26.01 U$3.P$3
  Bottom 0.305: v36.01,16.01 36.01,16.86 39.29,20.14 39.29,27.35 39.01,27.63 v39.01,29.89 | v32.01,16.01 21.88,16.01 20.48,14.61 8.55,14.61 3.69,19.46 3.69,22.84 5.67,24.82 v5.67,26.01
XTAL1
  Top 0.203: Y1.3 25.33,13.93 25.33,15.96 R1.1 25.23,16.06 24.82,16.47 24.82,19.82 IC3.34
XTAL2
  Top 0.203: Y1.1 23.5,13.93 23.5,15.96 R1.2 23.6,16.06 24.31,16.77 24.31,19.82 IC3.33

### Text on the board
ReferenceLC: L | TX | RX
test-probe: ISP2_6 | ISP2_4 | ISP2_2 | ISP2_1 | ISP2_3 | ISP2_5 | USB1_D-